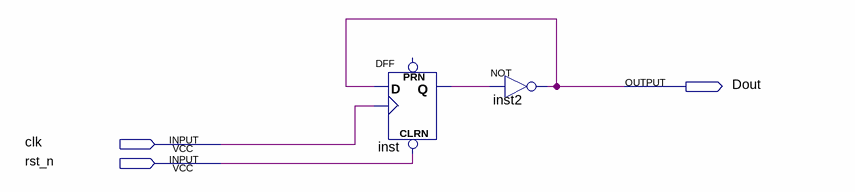
[diagram p0: schematic sheet]
// Quartus schematic count_2.bdf as structural Verilog: 2 symbols, 3 pins
module count_2 (
  input  clk,
  input  rst_n,
  output Dout
);

  wire inst_q;

  DFF inst (.CLRN(rst_n), .CLK(clk), .D(Dout), .Q(inst_q));  // open: PRN
  not inst2 (Dout, inst_q);
endmodule
